# EAGLE design stm32-usb-ble-devkit (EAGLE 9.1.3)

## Sheet 1 of 4
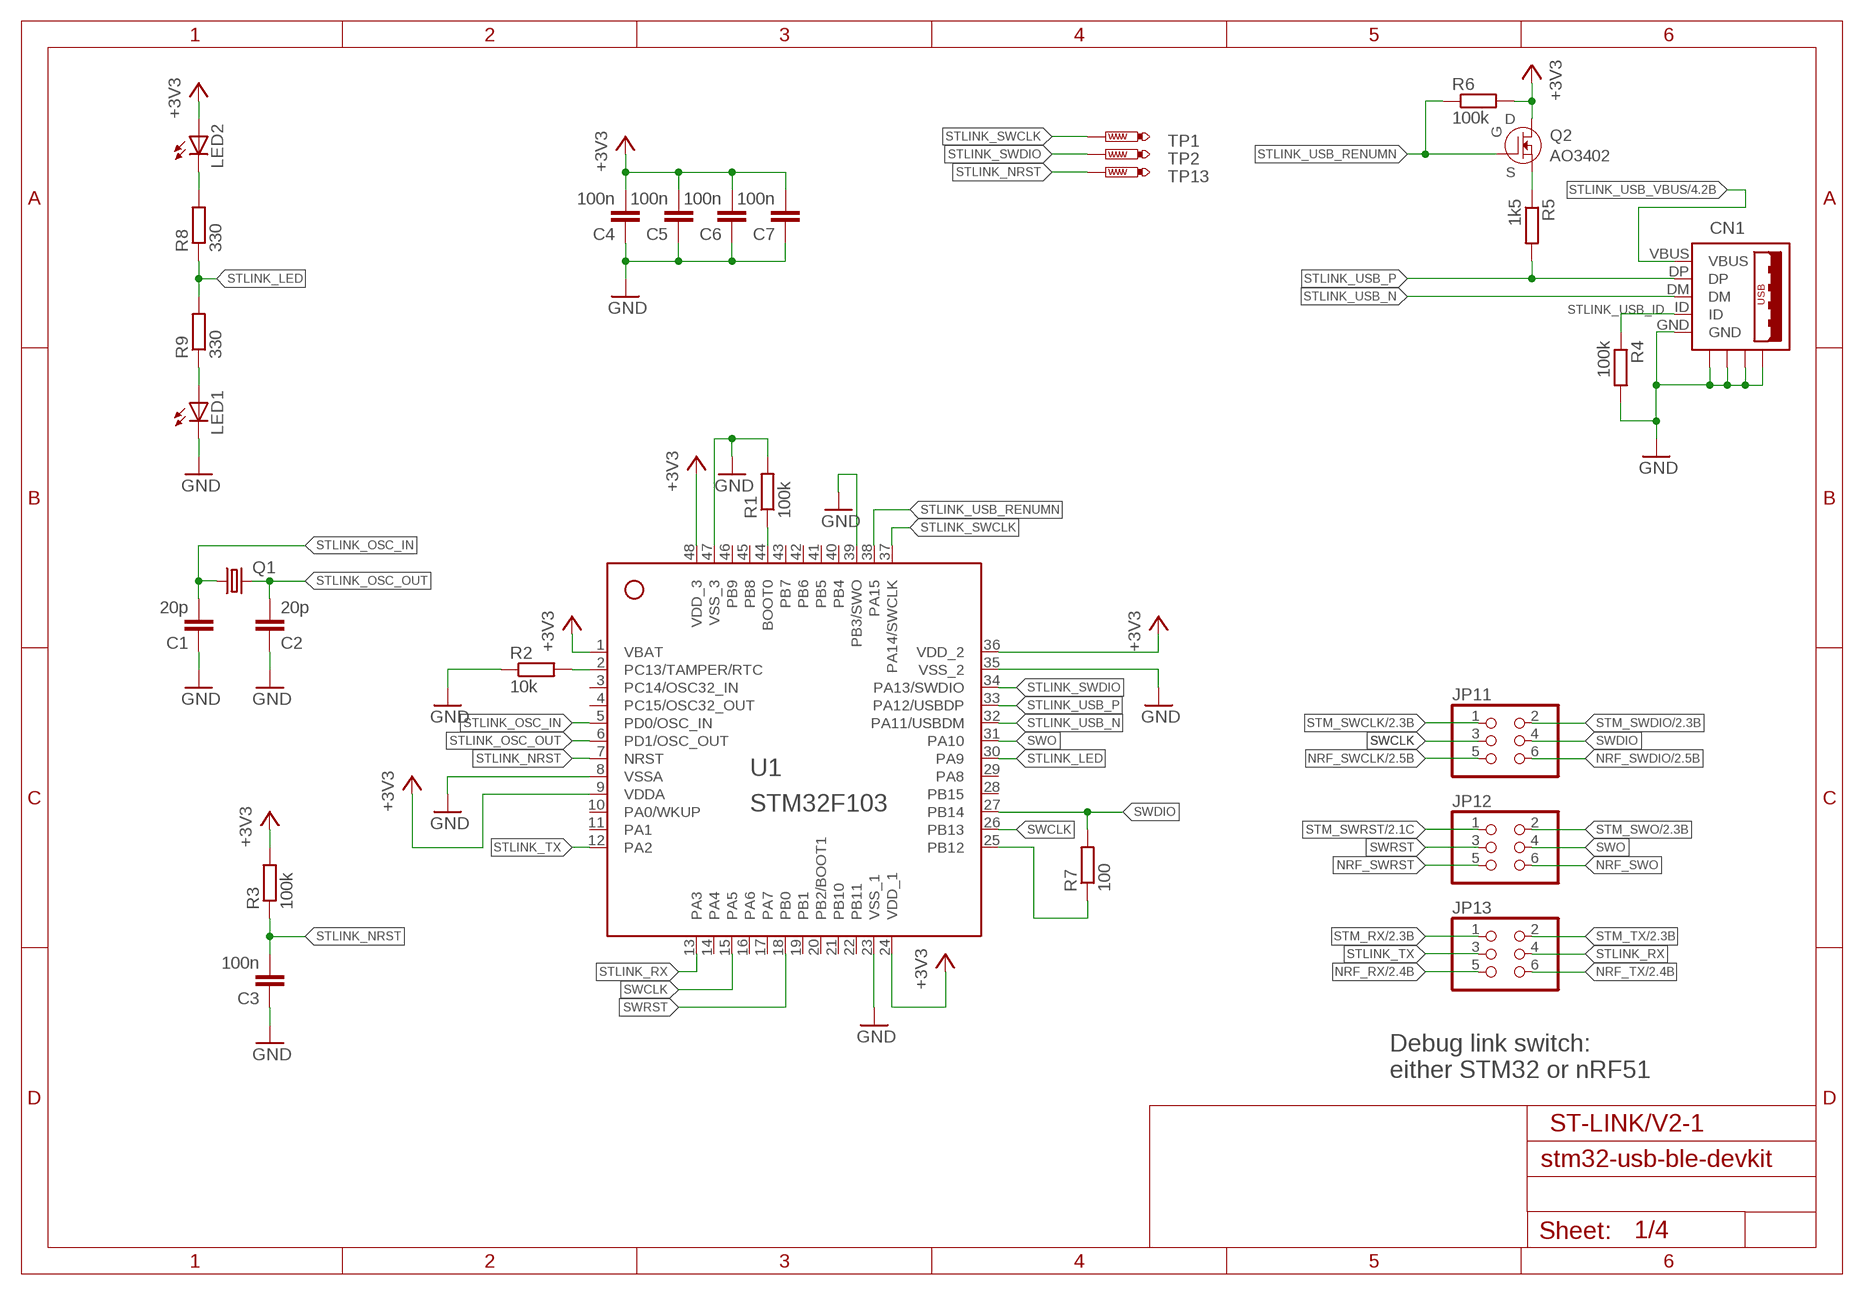
[diagram p0: schematic, sheet 1]

### Parts
C1  20p  C0603  [0603]
C2  20p  C0603  [0603]
C3  100n  C0603  [0603]
C4  100n  C0603  [0603]
C5  100n  C0603  [0603]
C6  100n  C0603  [0603]
C7  100n  C0603  [0603]
CN1  USB-MICROB-2TABS  [USB-MICROB-2]
JP11  PINHD-2X3  [2X03]
JP12  PINHD-2X3  [2X03]
JP13  PINHD-2X3  [2X03]
LED1  LEDCHIP-LED0603  [CHIP-LED0603]
LED2  LEDCHIP-LED0603  [CHIP-LED0603]
Q1  CRYSTALHC49S  [HC49/S]
Q2  AO3402  [SOT23-3]
R1  100k  RR0603  [R0603]
R2  10k  RR0603  [R0603]
R3  100k  RR0603  [R0603]
R4  100k  RR0603  [R0603]
R5  1k5  RR0603  [R0603]
R6  100k  RR0603  [R0603]
R7  100  RR0603  [R0603]
R8  330  RR0603  [R0603]
R9  330  RR0603  [R0603]
TP1  PTR1B1,27  [B1,27]
TP2  PTR1B1,27  [B1,27]
TP13  PTR1B1,27  [B1,27]
U1  STM32F103-48LQFP  [LQFP-48]

### Nets
+3V3: C4.2 C5.2 C6.2 C7.2 LED2.A Q2.3(D) R3.2 R6.2 U1.1(VBAT) U1.9(VDDA) U1.24(VDD_1) U1.36(VDD_2) U1.48(VDD_3) ; also sheet 2,3,4
GND: C1.1 C2.1 C3.1 C4.1 C5.1 C6.1 C7.1 CN1.GND CN1.GND@1(GND) CN1.GND@2(GND) CN1.GND@3(GND) CN1.GND@4(GND) LED1.C R1.2 R2.1 R4.2 U1.8(VSSA) U1.23(VSS_1) U1.35(VSS_2) U1.39(PB3/SWO) U1.47(VSS_3) ; also sheet 2,3,4
NRF_RX: JP13.5 ; also sheet 2
NRF_SWCLK: JP11.5 ; also sheet 2
NRF_SWDIO: JP11.6 ; also sheet 2
NRF_SWO: JP12.6
NRF_SWRST: JP12.5
NRF_TX: JP13.6 ; also sheet 2
STLINK_BOOT0: R1.1 U1.44(BOOT0)
STLINK_LED: R8.1 R9.2 U1.30(PA9)
STLINK_LED_RB: LED1.A R9.1
STLINK_LED_RT: LED2.C R8.2
STLINK_NRST: C3.2 R3.1 TP13.TP U1.7(NRST)
STLINK_OSC_IN: C1.2 Q1.1 U1.5(PD0/OSC_IN)
STLINK_OSC_OUT: C2.2 Q1.2 U1.6(PD1/OSC_OUT)
STLINK_PC13: R2.2 U1.2(PC13/TAMPER/RTC)
STLINK_RX: JP13.4 U1.13(PA3)
STLINK_SWCLK: TP1.TP U1.37(PA14/SWCLK)
STLINK_SWDIO: TP2.TP U1.34(PA13/SWDIO)
STLINK_SWDIO_PD: R7.1 U1.25(PB12)
STLINK_TX: JP13.3 U1.12(PA2)
STLINK_USB_ID: CN1.ID R4.1
STLINK_USB_N: CN1.DM U1.32(PA11/USBDM)
STLINK_USB_P: CN1.DP R5.2 U1.33(PA12/USBDP)
STLINK_USB_RENUM_PU: Q2.2(S) R5.1
STLINK_USB_RENUMN: Q2.1(G) R6.1 U1.38(PA15)
STLINK_USB_VBUS: CN1.VBUS ; also sheet 4
STM_RX: JP13.1 ; also sheet 2
STM_SWCLK: JP11.1 ; also sheet 2
STM_SWDIO: JP11.2 ; also sheet 2
STM_SWO: JP12.2 ; also sheet 2
STM_SWRST: JP12.1 ; also sheet 2
STM_TX: JP13.2 ; also sheet 2
SWCLK: JP11.3 U1.15(PA5) U1.26(PB13)
SWDIO: JP11.4 R7.2 U1.27(PB14)
SWO: JP12.4 U1.31(PA10)
SWRST: JP12.3 U1.18(PB0)
Unconnected: U1.3(PC14/OSC32_IN) U1.4(PC15/OSC32_OUT) U1.10(PA0/WKUP) U1.11(PA1) U1.14(PA4) U1.16(PA6) U1.17(PA7) U1.19(PB1) U1.20(PB2/BOOT1) U1.21(PB10) U1.22(PB11) U1.28(PB15) U1.29(PA8) U1.40(PB4) U1.41(PB5) U1.42(PB6) U1.43(PB7) U1.45(PB8) U1.46(PB9)

### Notes on the sheet
- Debug link switch:
  either STM32 or nRF51
- ST-LINK/V2-1

## Sheet 2 of 4
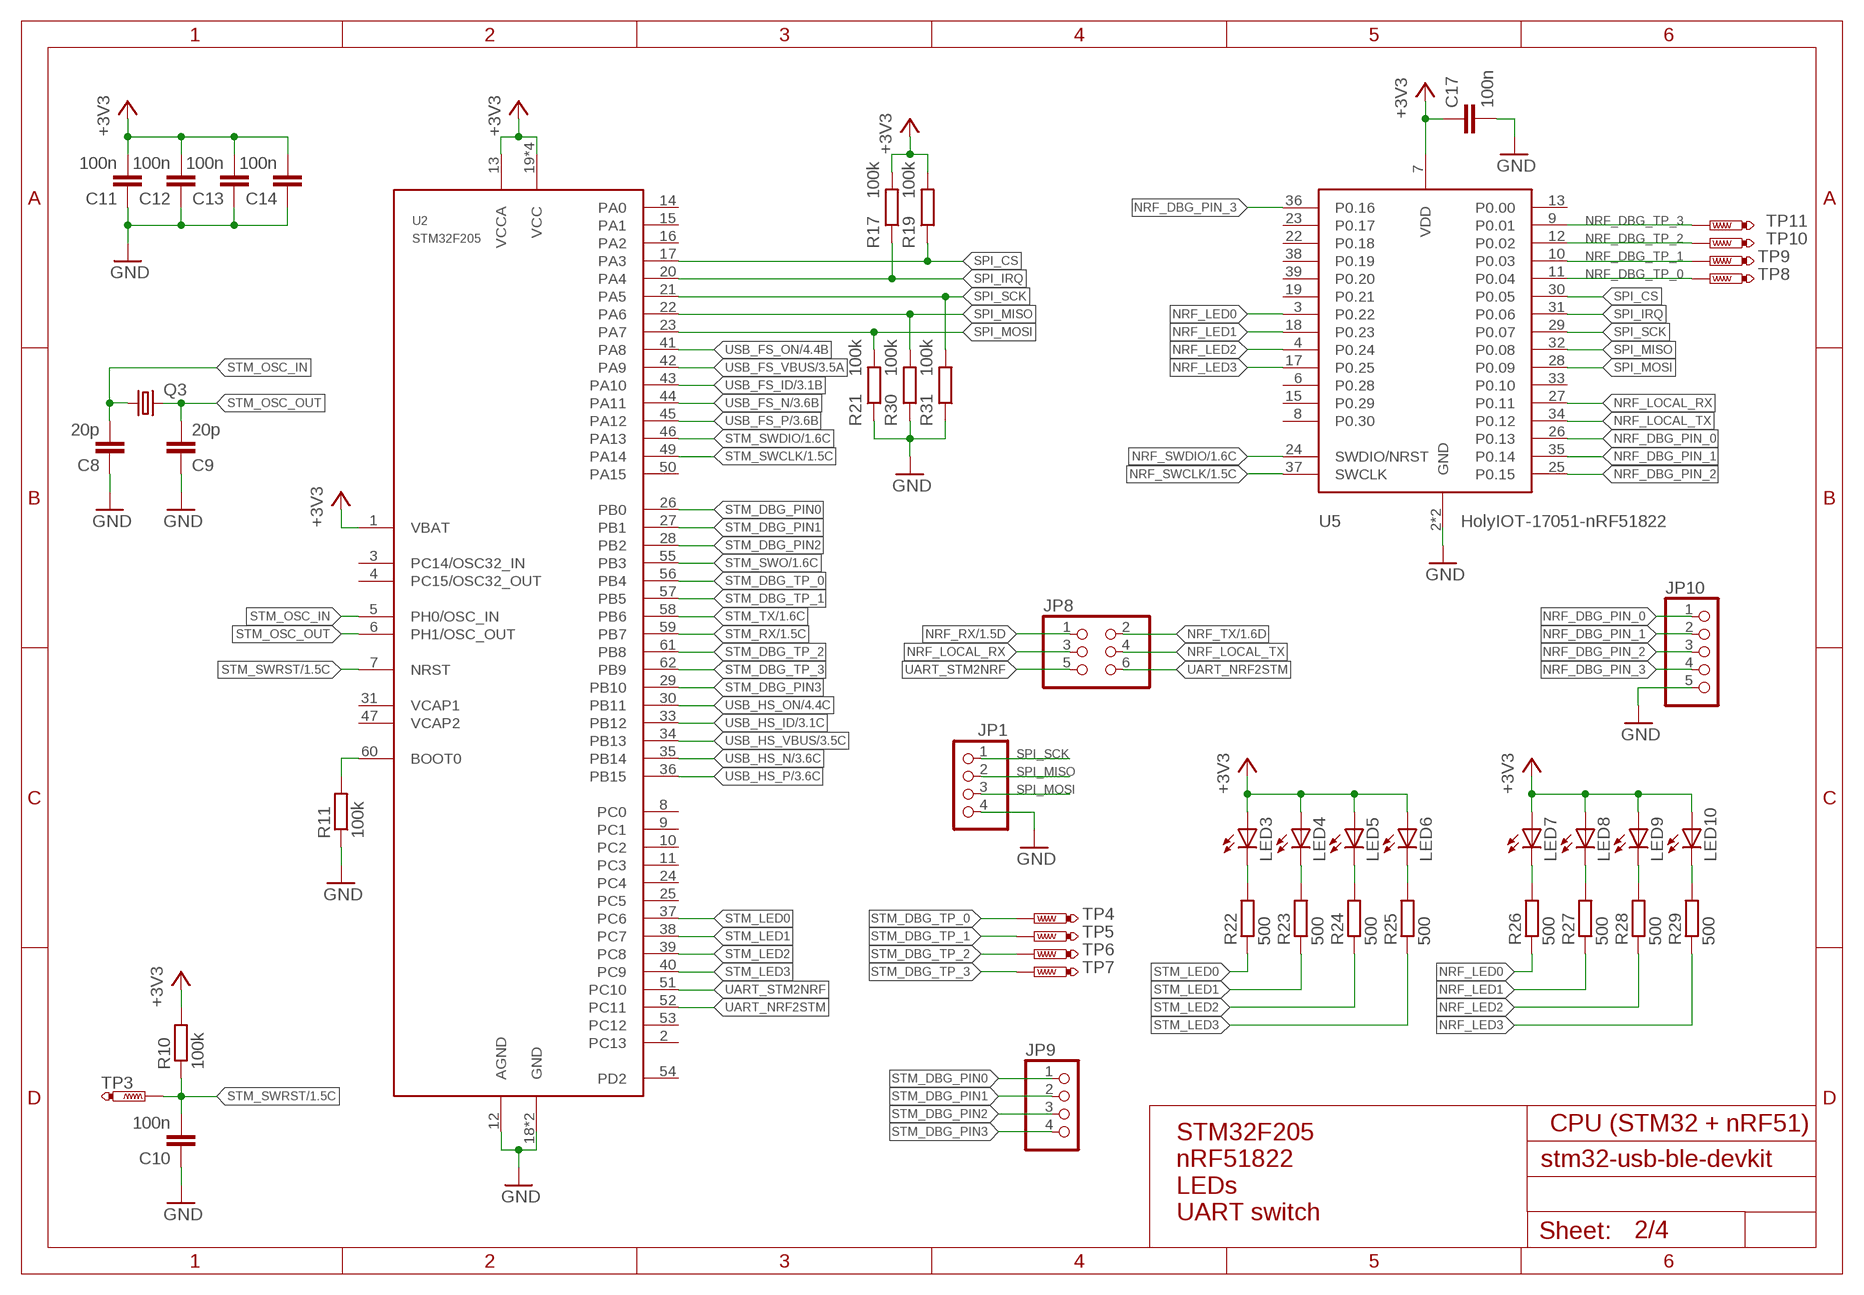
[diagram p1: schematic, sheet 2]

### Parts
C8  20p  C0603  [0603]
C9  20p  C0603  [0603]
C10  100n  C0603  [0603]
C11  100n  C0603  [0603]
C12  100n  C0603  [0603]
C13  100n  C0603  [0603]
C14  100n  C0603  [0603]
C17  100n  C0603  [0603]
JP1  PINHD-1X4  [1X04]
JP8  PINHD-2X3  [2X03]
JP9  PINHD-1X4  [1X04]
JP10  PINHD-1X5  [1X05]
LED3  LEDCHIP-LED0603  [CHIP-LED0603]
LED4  LEDCHIP-LED0603  [CHIP-LED0603]
LED5  LEDCHIP-LED0603  [CHIP-LED0603]
LED6  LEDCHIP-LED0603  [CHIP-LED0603]
LED7  LEDCHIP-LED0603  [CHIP-LED0603]
LED8  LEDCHIP-LED0603  [CHIP-LED0603]
LED9  LEDCHIP-LED0603  [CHIP-LED0603]
LED10  LEDCHIP-LED0603  [CHIP-LED0603]
Q3  CRYSTALHC49S  [HC49/S]
R10  100k  RR0603  [R0603]
R11  100k  RR0603  [R0603]
R17  100k  RR0603  [R0603]
R19  100k  RR0603  [R0603]
R21  100k  RR0603  [R0603]
R22  500  RR0603  [R0603]
R23  500  RR0603  [R0603]
R24  500  RR0603  [R0603]
R25  500  RR0603  [R0603]
R26  500  RR0603  [R0603]
R27  500  RR0603  [R0603]
R28  500  RR0603  [R0603]
R29  500  RR0603  [R0603]
R30  100k  RR0603  [R0603]
R31  100k  RR0603  [R0603]
TP3  PTR1B1,27  [B1,27]
TP4  PTR1B1,27  [B1,27]
TP5  PTR1B1,27  [B1,27]
TP6  PTR1B1,27  [B1,27]
TP7  PTR1B1,27  [B1,27]
TP8  PTR1B1,27  [B1,27]
TP9  PTR1B1,27  [B1,27]
TP10  PTR1B1,27  [B1,27]
TP11  PTR1B1,27  [B1,27]
U2  STM32F205-64  [LQFP-64]
U5  HOLYIOT-17051-NRF51822  [HOLYIOT-17051-NRF51822]

### Nets
+3V3: C11.2 C12.2 C13.2 C14.2 C17.1 LED3.A LED4.A LED5.A LED6.A LED7.A LED8.A LED9.A LED10.A R10.2 R17.2 R19.2 U2.1(VBAT) U2.13(VCCA) U2.19(VCC) U2.32(VCC) U2.48(VCC) U2.64(VCC) U5.7(VDD) ; also sheet 1,3,4
BOOT0: R11.2 U2.60(BOOT0)
GND: C8.1 C9.1 C10.1 C11.1 C12.1 C13.1 C14.1 C17.2 JP1.4 JP10.5 R11.1 R21.1 R30.1 R31.1 U2.12(AGND) U2.18(GND) U2.63(GND) U5.2(GND) U5.14(GND) ; also sheet 1,3,4
NRF_DBG_PIN_0: JP10.1 U5.26(P0.13)
NRF_DBG_PIN_1: JP10.2 U5.35(P0.14)
NRF_DBG_PIN_2: JP10.3 U5.25(P0.15)
NRF_DBG_PIN_3: JP10.4 U5.36(P0.16)
NRF_DBG_TP_0: TP8.TP U5.11(P0.04)
NRF_DBG_TP_1: TP9.TP U5.10(P0.03)
NRF_DBG_TP_2: TP10.TP U5.12(P0.02)
NRF_DBG_TP_3: TP11.TP U5.9(P0.01)
NRF_LED0: R26.1 U5.3(P0.22)
NRF_LED1: R27.1 U5.18(P0.23)
NRF_LED2: R28.1 U5.4(P0.24)
NRF_LED3: R29.1 U5.17(P0.25)
NRF_LEDR0: LED7.C R26.2
NRF_LEDR1: LED8.C R27.2
NRF_LEDR2: LED9.C R28.2
NRF_LEDR3: LED10.C R29.2
NRF_LOCAL_RX: JP8.3 U5.27(P0.11)
NRF_LOCAL_TX: JP8.4 U5.34(P0.12)
NRF_RX: JP8.1 ; also sheet 1
NRF_SWCLK: U5.37(SWCLK) ; also sheet 1
NRF_SWDIO: U5.24(SWDIO/NRST) ; also sheet 1
NRF_TX: JP8.2 ; also sheet 1
SPI_CS: R19.1 U2.17(PA3) U5.30(P0.05)
SPI_IRQ: R17.1 U2.20(PA4) U5.31(P0.06)
SPI_MISO: JP1.2 R30.2 U2.22(PA6) U5.32(P0.08)
SPI_MOSI: JP1.3 R21.2 U2.23(PA7) U5.28(P0.09)
SPI_SCK: JP1.1 R31.2 U2.21(PA5) U5.29(P0.07)
STM_DBG_PIN0: JP9.1 U2.26(PB0)
STM_DBG_PIN1: JP9.2 U2.27(PB1)
STM_DBG_PIN2: JP9.3 U2.28(PB2)
STM_DBG_PIN3: JP9.4 U2.29(PB10)
STM_DBG_TP_0: TP4.TP U2.56(PB4)
STM_DBG_TP_1: TP5.TP U2.57(PB5)
STM_DBG_TP_2: TP6.TP U2.61(PB8)
STM_DBG_TP_3: TP7.TP U2.62(PB9)
STM_LED0: R22.1 U2.37(PC6)
STM_LED1: R23.1 U2.38(PC7)
STM_LED2: R24.1 U2.39(PC8)
STM_LED3: R25.1 U2.40(PC9)
STM_LEDR0: LED3.C R22.2
STM_LEDR1: LED4.C R23.2
STM_LEDR3: LED6.C R25.2
STM_LEDR_2: LED5.C R24.2
STM_OSC_IN: C8.2 Q3.1 U2.5(PH0/OSC_IN)
STM_OSC_OUT: C9.2 Q3.2 U2.6(PH1/OSC_OUT)
STM_RX: U2.59(PB7) ; also sheet 1
STM_SWCLK: U2.49(PA14) ; also sheet 1
STM_SWDIO: U2.46(PA13) ; also sheet 1
STM_SWO: U2.55(PB3) ; also sheet 1
STM_SWRST: C10.2 R10.1 TP3.TP U2.7(NRST) ; also sheet 1
STM_TX: U2.58(PB6) ; also sheet 1
UART_NRF2STM: JP8.6 U2.52(PC11)
UART_STM2NRF: JP8.5 U2.51(PC10)
USB_FS_ID: U2.43(PA10) ; also sheet 3
USB_FS_N: U2.44(PA11) ; also sheet 3
USB_FS_ON: U2.41(PA8) ; also sheet 4
USB_FS_P: U2.45(PA12) ; also sheet 3
USB_FS_VBUS: U2.42(PA9) ; also sheet 3,4
USB_HS_ID: U2.33(PB12) ; also sheet 3
USB_HS_N: U2.35(PB14) ; also sheet 3
USB_HS_ON: U2.30(PB11) ; also sheet 4
USB_HS_P: U2.36(PB15) ; also sheet 3
USB_HS_VBUS: U2.34(PB13) ; also sheet 3,4
Unconnected: U2.2(PC13) U2.3(PC14/OSC32_IN) U2.4(PC15/OSC32_OUT) U2.8(PC0) U2.9(PC1) U2.10(PC2) U2.11(PC3) U2.14(PA0) U2.15(PA1) U2.16(PA2) U2.24(PC4) U2.25(PC5) U2.31(VCAP1) U2.47(VCAP2) U2.50(PA15) U2.53(PC12) U2.54(PD2) U5.6(P0.28) U5.8(P0.30) U5.13(P0.00) U5.15(P0.29) U5.19(P0.21) U5.22(P0.18) U5.23(P0.17) U5.33(P0.10) U5.38(P0.19) U5.39(P0.20)

### Notes on the sheet
- CPU (STM32 + nRF51)
- STM32F205
  nRF51822
  LEDs
  UART switch

## Sheet 3 of 4
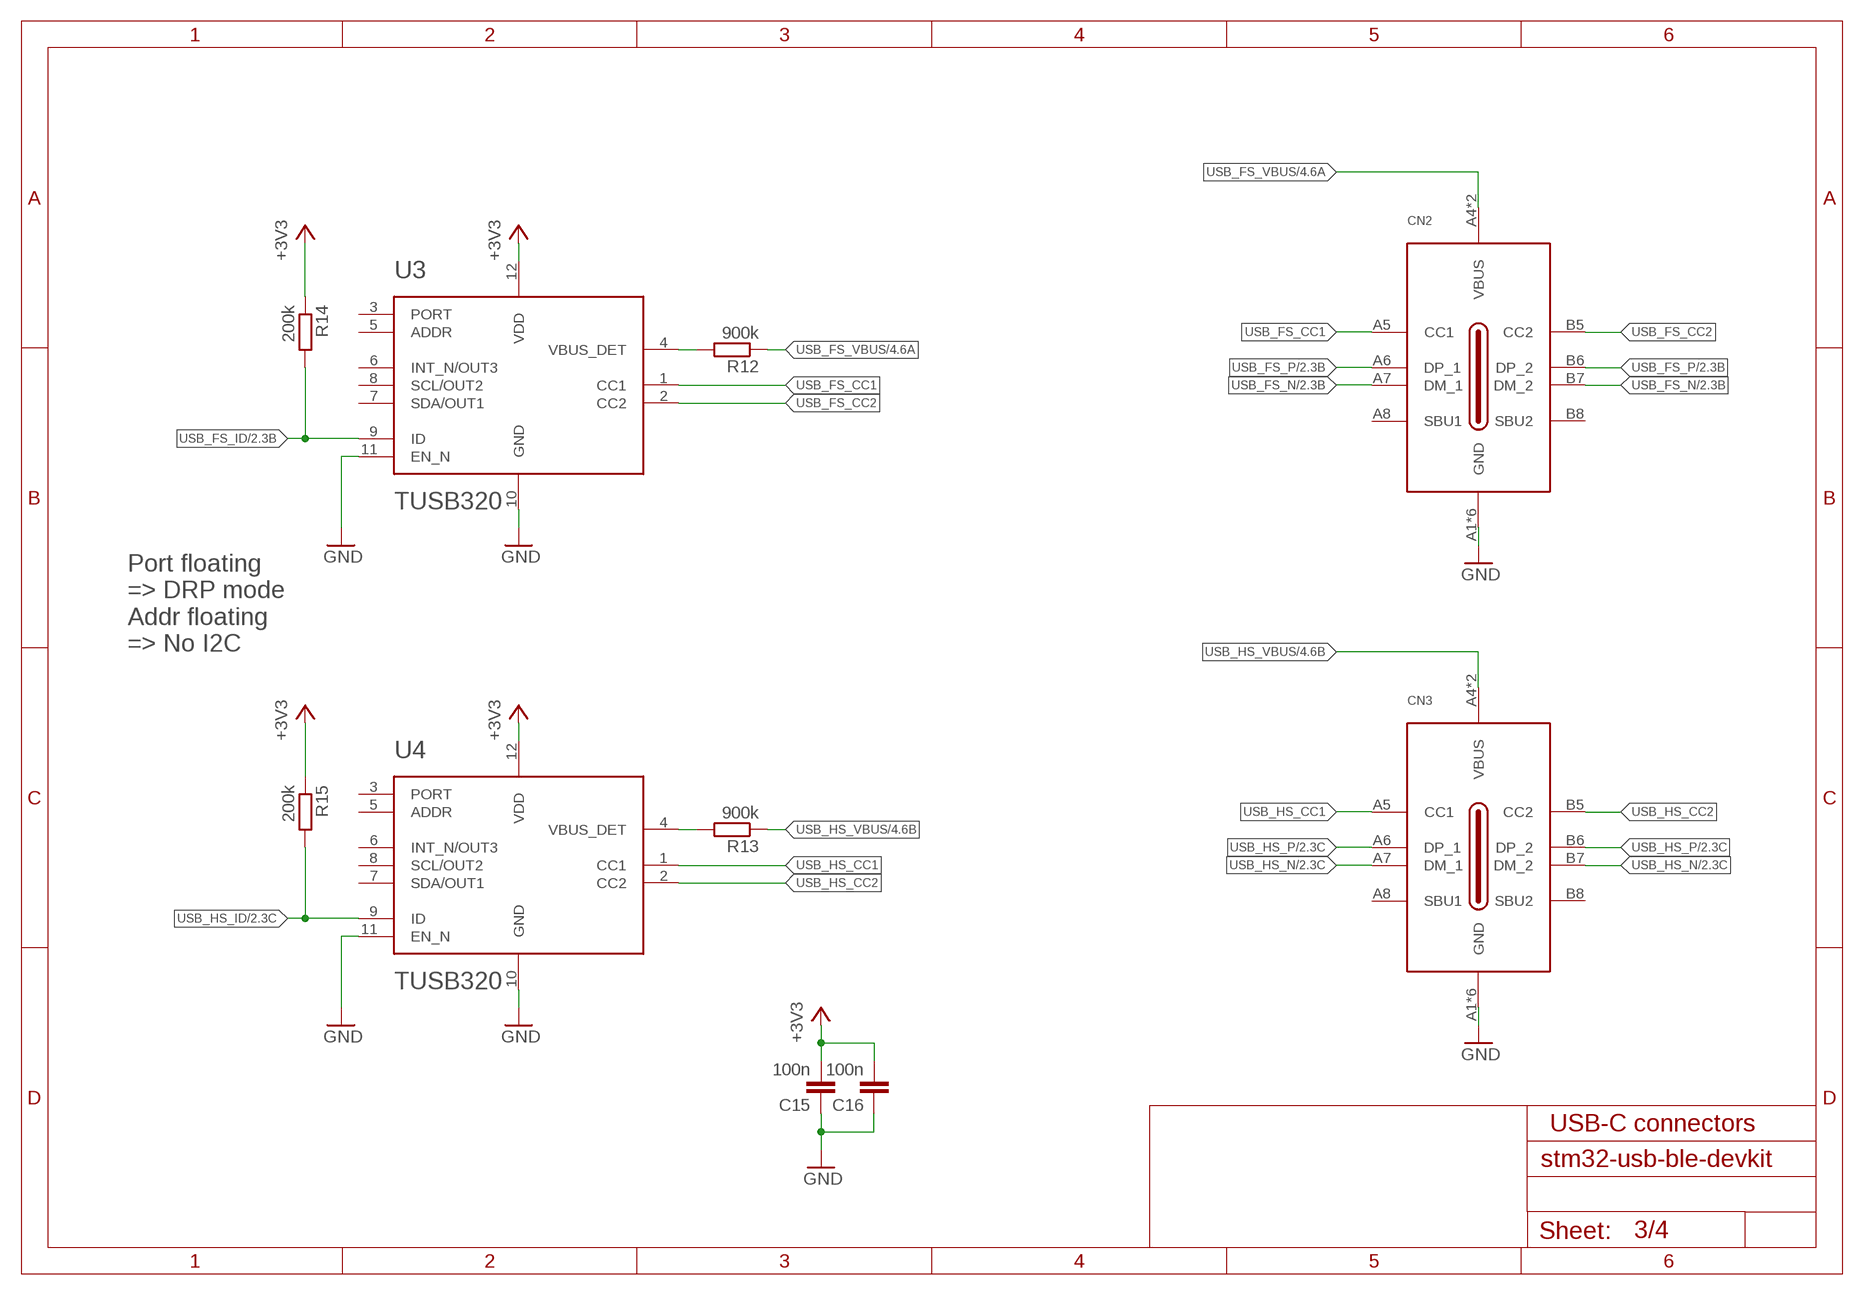
[diagram p2: schematic, sheet 3]

### Parts
C15  100n  C0603  [0603]
C16  100n  C0603  [0603]
CN2  USB-C-2.0-FEMALE  [USB-C-FEMALE]
CN3  USB-C-2.0-FEMALE  [USB-C-FEMALE]
R12  900k  RR0603  [R0603]
R13  900k  RR0603  [R0603]
R14  200k  RR0603  [R0603]
R15  200k  RR0603  [R0603]
U3  TUSB320  [X2QFN-0.4]
U4  TUSB320  [X2QFN-0.4]

### Nets
+3V3: C15.2 C16.2 R14.1 R15.1 U3.12(VDD) U4.12(VDD) ; also sheet 1,2,4
GND: C15.1 C16.1 CN2.A1(GND) CN2.A12(GND) CN2.G1(GND) CN2.G2(GND) CN2.G3(GND) CN2.G4(GND) CN3.A1(GND) CN3.A12(GND) CN3.G1(GND) CN3.G2(GND) CN3.G3(GND) CN3.G4(GND) U3.10(GND) U3.11(EN_N) U4.10(GND) U4.11(EN_N) ; also sheet 1,2,4
USB_FS_CC1: CN2.A5(CC1) U3.1(CC1)
USB_FS_CC2: CN2.B5(CC2) U3.2(CC2)
USB_FS_ID: R14.2 U3.9(ID) ; also sheet 2
USB_FS_N: CN2.A7(DM_1) CN2.B7(DM_2) ; also sheet 2
USB_FS_P: CN2.A6(DP_1) CN2.B6(DP_2) ; also sheet 2
USB_FS_VBUS: CN2.A4(VBUS) CN2.A9(VBUS) R12.1 ; also sheet 2,4
USB_FS_VBUS_DET: R12.2 U3.4(VBUS_DET)
USB_HS_CC1: CN3.A5(CC1) U4.1(CC1)
USB_HS_CC2: CN3.B5(CC2) U4.2(CC2)
USB_HS_ID: R15.2 U4.9(ID) ; also sheet 2
USB_HS_N: CN3.A7(DM_1) CN3.B7(DM_2) ; also sheet 2
USB_HS_P: CN3.A6(DP_1) CN3.B6(DP_2) ; also sheet 2
USB_HS_VBUS: CN3.A4(VBUS) CN3.A9(VBUS) R13.1 ; also sheet 2,4
USB_HS_VBUS_DET: R13.2 U4.4(VBUS_DET)
Unconnected: CN2.A8(SBU1) CN2.B8(SBU2) CN3.A8(SBU1) CN3.B8(SBU2) U3.3(PORT) U3.5(ADDR) U3.6(INT_N/OUT3) U3.7(SDA/OUT1) U3.8(SCL/OUT2) U4.3(PORT) U4.5(ADDR) U4.6(INT_N/OUT3) U4.7(SDA/OUT1) U4.8(SCL/OUT2)

### Notes on the sheet
- Port floating
  => DRP mode
  Addr floating
  => No I2C
- USB-C connectors

## Sheet 4 of 4
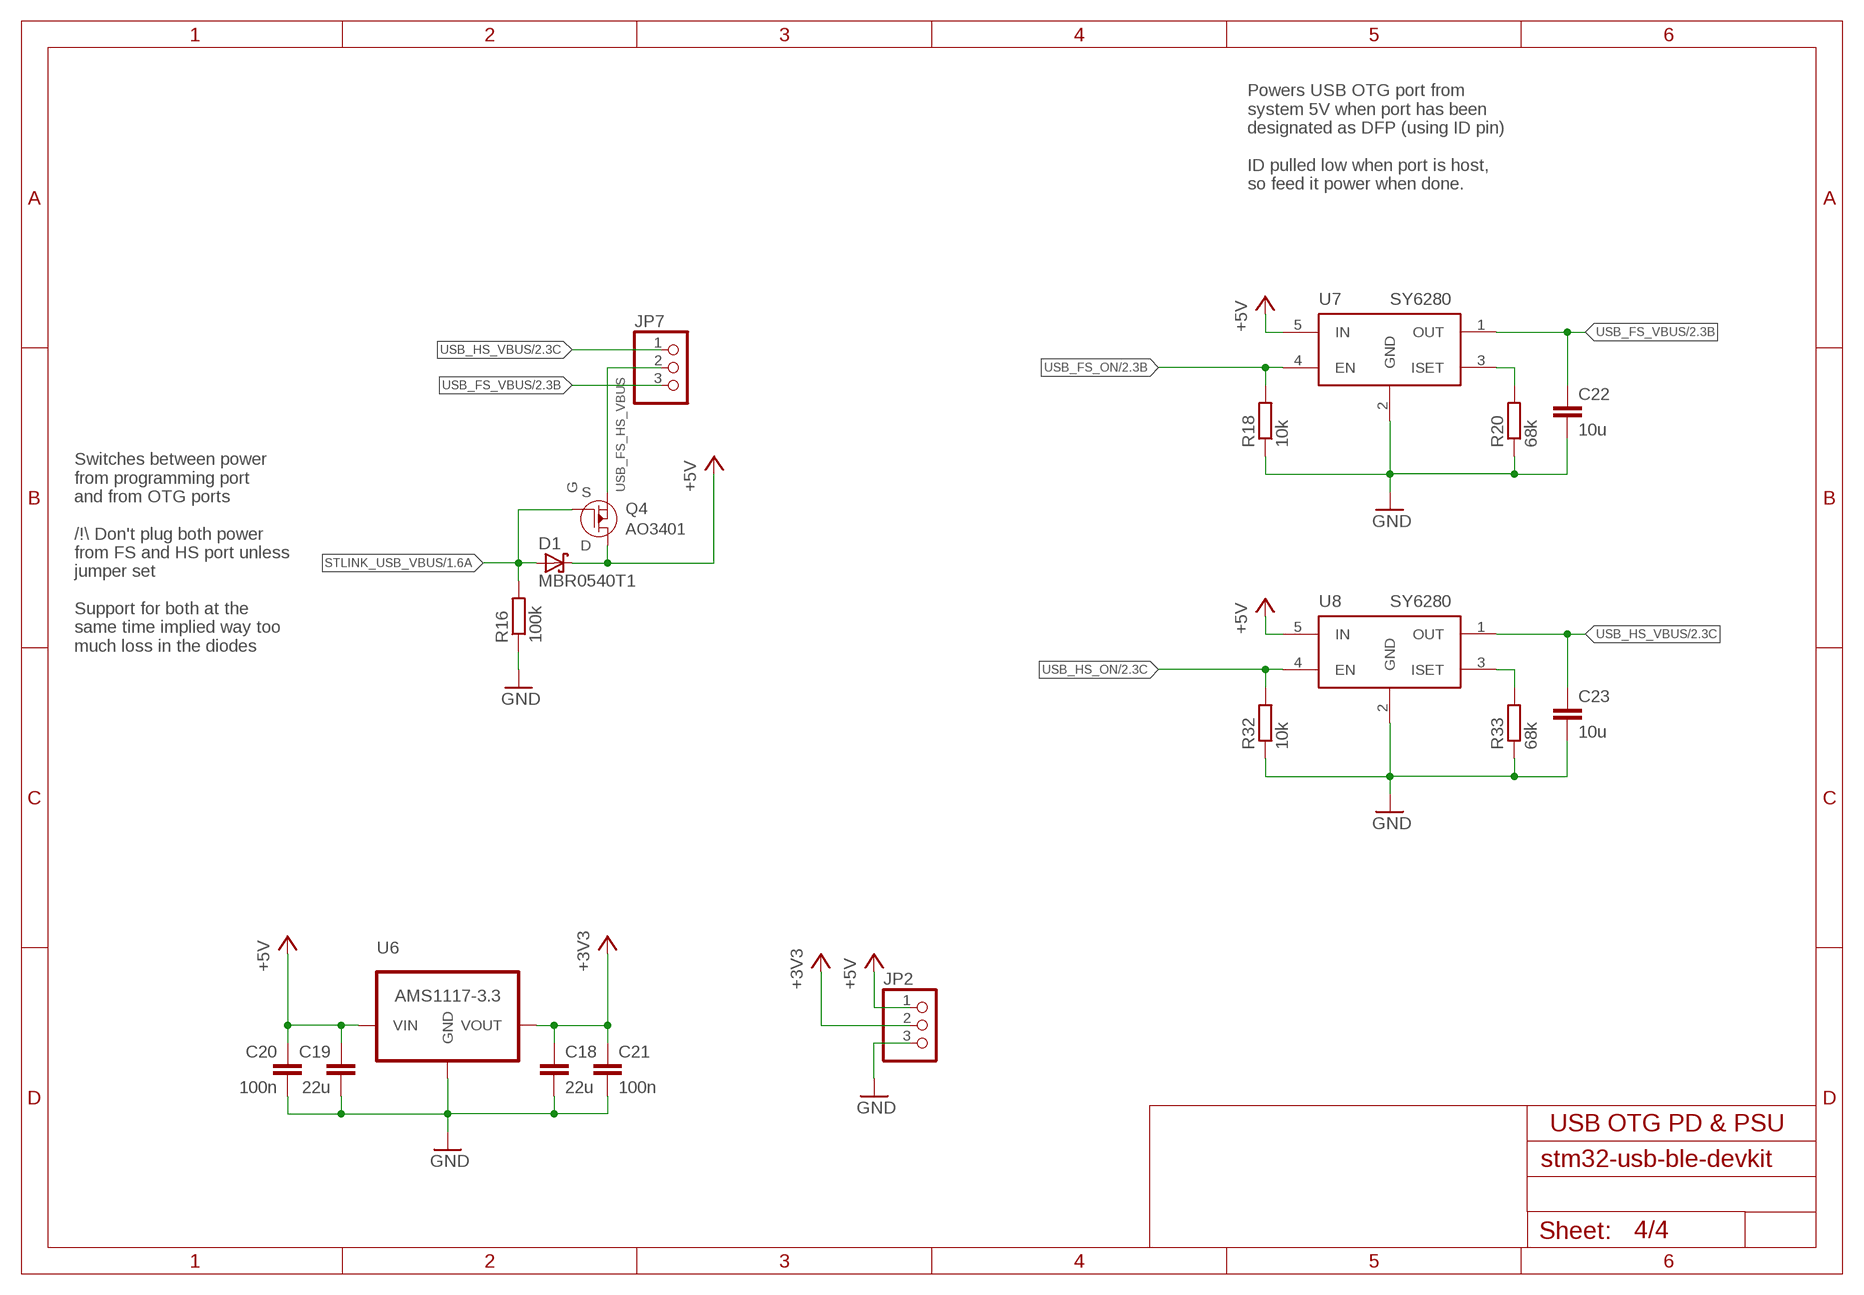
[diagram p3: schematic, sheet 4]

### Parts
C18  22u  C0603  [0603]
C19  22u  C0603  [0603]
C20  100n  C0603  [0603]
C21  100n  C0603  [0603]
C22  10u  C0603  [0603]
C23  10u  C0603  [0603]
D1  MBR0540T1  [SOD123]
JP2  PINHD-1X3  [1X03]
JP7  PINHD-1X3  [1X03]
Q4  AO3401  [SOT23-3]
R16  100k  RR0603  [R0603]
R18  10k  RR0603  [R0603]
R20  68k  RR0603  [R0603]
R32  10k  RR0603  [R0603]
R33  68k  RR0603  [R0603]
U6  AMS1117-3.3  LDOAMS1117  [SOT223]
U7  SY6280  [SOT23-5]
U8  SY6280  [SOT23-5]

### Nets
+3V3: C18.1 C21.1 JP2.2 U6.2(VOUT) ; also sheet 1,2,3
+5V: C19.1 C20.1 D1.C JP2.1 Q4.3(D) U6.3(VIN) U7.5(IN) U8.5(IN)
GND: C18.2 C19.2 C20.2 C21.2 C22.2 C23.2 JP2.3 R16.1 R18.1 R20.1 R32.1 R33.1 U6.1(GND) U7.2(GND) U8.2(GND) ; also sheet 1,2,3
STLINK_USB_VBUS: D1.A Q4.1(G) R16.2 ; also sheet 1
USB_FS_HS_VBUS: JP7.2 Q4.2(S)
USB_FS_ISET: R20.2 U7.3(ISET)
USB_FS_ON: R18.2 U7.4(EN) ; also sheet 2
USB_FS_VBUS: C22.1 JP7.3 U7.1(OUT) ; also sheet 2,3
USB_HS_ISET: R33.2 U8.3(ISET)
USB_HS_ON: R32.2 U8.4(EN) ; also sheet 2
USB_HS_VBUS: C23.1 JP7.1 U8.1(OUT) ; also sheet 2,3

### Notes on the sheet
- Powers USB OTG port from
  system 5V when port has been
  designated as DFP (using ID pin)
  
  ID pulled low when port is host,
  so feed it power when done.
- Switches between power
  from programming port
  and from OTG ports
  
  /\!\\ Don't plug both power
  from FS and HS port unless
  jumper set
  
  Support for both at the
  same time implied way too
  much loss in the diodes
- USB OTG PD & PSU

## Library data of the parts
C1-C23 = tuetuopay:C
CN1 = tuetuopay:USB-MICROB
CN2 CN3 = tuetuopay:USB-C-2.0-FEMALE: 90° female USB-C socket up to USB 2.0
D1 = tuetuopay:MBR0540T1
JP1 JP9 = tuetuopay:PINHD-1X4: PIN HEADER
JP2 JP7 = tuetuopay:PINHD-1X3: PIN HEADER
JP8 JP11-JP13 = pinhead:PINHD-2X3: PIN HEADER
JP10 = tuetuopay:PINHD-1X5: PIN HEADER
LED1-LED10 = led:LED: LED OSRAM: - CHIPLED LG R971, LG N971, LY N971, LG Q971, LY Q971, LO R971, LY R971 LH N974, LH R974 LS Q976, LO Q976, LY Q976 LO Q996 - Hyper CHIPLED LW Q18S LB Q993, LB Q99A, LB R99A - SideLED LS A670, LO A670, LY A670, LG A670, LP A670 LB A673, LV A673, LT A673, LW A673 LH A674 LY A675 LS A676, LA A676, LO A676, LY A676, LW A676 LS A679, LY A679, LG A679 - Hyper Micro SIDELED® LS Y876, LA Y876, LO Y876, LY Y876 LT Y87S - SmartLED LW L88C, LW L88S LB L89C, LB L89S, LG L890 LS L89K, LO L89K, LY L89K LS L896, LA L896, LO L896, LY L896 - TOPLED LS T670, LO T670, LY T670, LG T670, LP T670 LSG T670, LSP T670, LSY T670, LOP T670, LYG T670 LG T671, LOG T671, LSG T671 LB T673, LV T673, LT T673, LW T673 LH T674 LS T676, LA T676, LO T676, LY T676, LB T676, LH T676, LSB T676, LW T676 LB T67C, LV T67C, LT T67C, LS T67K, LO T67K, LY T67K, LW E67C LS E67B, LA E67B, LO E67B, LY E67B, LB E67C, LV E67C, LT E67C LW T67C LS T679, LY T679, LG T679 LS T770, LO T770, LY T770, LG T770, LP T770 LB T773, LV T773, LT T773, LW T773 LH T774 LS E675, LA E675, LY E675, LS T675 LS T776, LA T776, LO T776, LY T776, LB T776 LHGB T686 LT T68C, LB T68C - Hyper Mini TOPLED® LB M676 - Mini TOPLED Santana® LG M470 LS M47K, LO M47K, LY M47K Source: http://www.osram.convergy.de LUXEON: - LUMILED® LXK2-PW12-R00, LXK2-PW12-S00, LXK2-PW14-U00, LXK2-PW14-V00 LXK2-PM12-R00, LXK2-PM12-S00, LXK2-PM14-U00 LXK2-PE12-Q00, LXK2-PE12-R00, LXK2-PE12-S00, LXK2-PE14-T00, LXK2-PE14-U00 LXK2-PB12-K00, LXK2-PB12-L00, LXK2-PB12-M00, LXK2-PB14-N00, LXK2-PB14-P00, LXK2-PB14-Q00 LXK2-PR12-L00, LXK2-PR12-M00, LXK2-PR14-Q00, LXK2-PR14-R00 LXK2-PD12-Q00, LXK2-PD12-R00, LXK2-PD12-S00 LXK2-PH12-R00, LXK2-PH12-S00 LXK2-PL12-P00, LXK2-PL12-Q00, LXK2-PL12-R00 Source: www.luxeon.com KINGBRIGHT: KA-3528ASYC Source: www.kingbright.com
Q1 Q3 = crystal:CRYSTAL: CRYSTAL; OC_FARNELL: 1667008; OC_NEWARK: unknown
Q2 = tuetuopay:AO3402
Q4 = tuetuopay:AO3401
R1-R33 = tuetuopay:R: RESISTOR, European symbol
TP1-TP11 TP13 = testpad:PTR1: TEST PIN
U1 = tuetuopay:STM32F103-48
U2 = tuetuopay:STM32F205-64
U3 U4 = tuetuopay:TUSB320
U5 = tuetuopay:HOLYIOT-17051-NRF51822
U6 = tuetuopay:LDO
U7 U8 = tuetuopay:SY6280

## Board
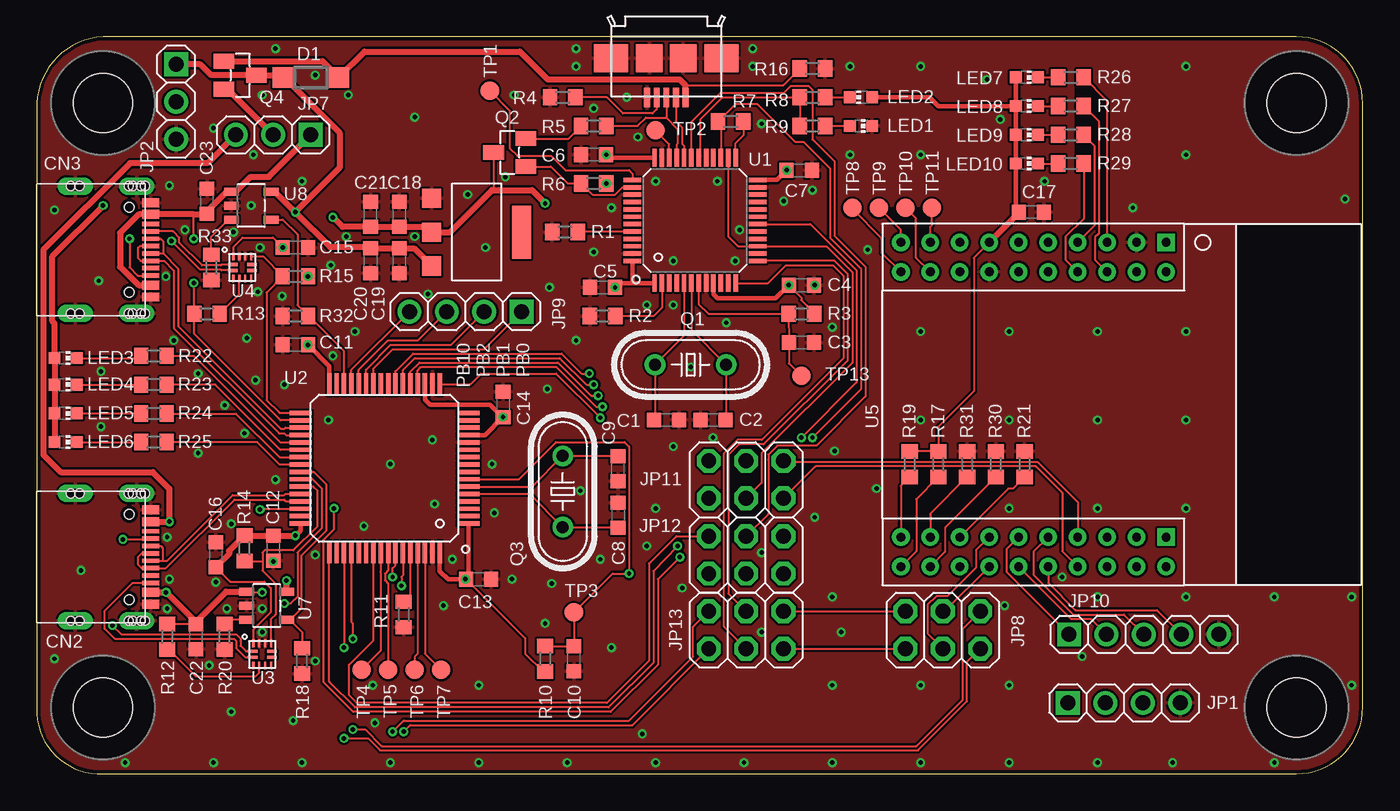
[diagram p4: board, top side]
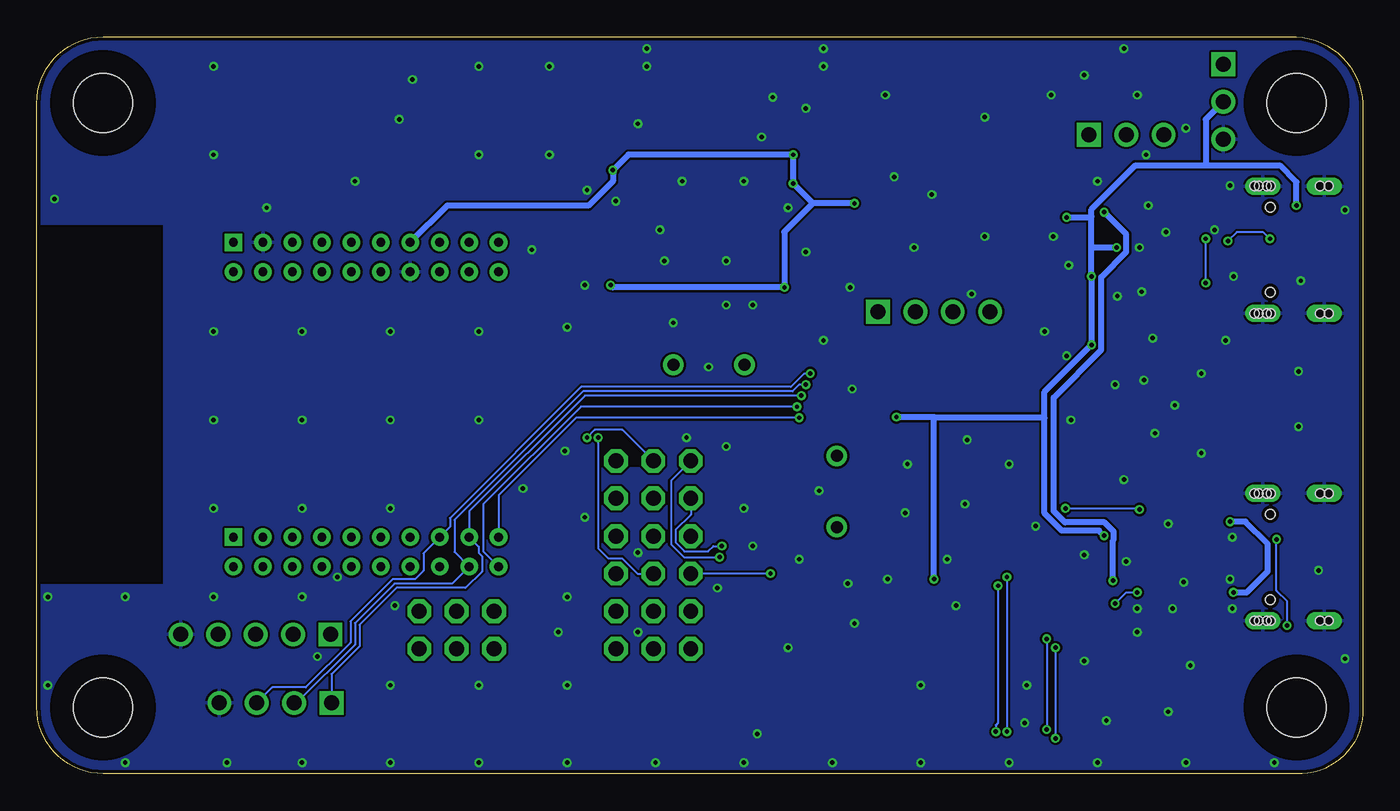
[diagram p5: board, bottom side, seen from below]

Size 90 x 50 mm. Coordinates in mm from the lower left corner, seen from the top.
Outline: 4.5,0 85.5,0 arc90 90,4.5 90,45.5 arc90 85.5,50 4.5,50 arc90 0,45.05 0,4.05 arc90 4.5,0
Copper layers (1*16): Top 0.035mm / dielectric 1.5mm / Bottom 0.035mm
Design rules "jlcpcb *": minimum track width 0.15mm, minimum drill 0.3mm, track to track 0.15mm, track to pad 0.15mm, pad to pad 0.15mm, via to via 0.15mm, smd to smd 0.15mm, copper to edge 0.25mm, drill to drill 6mil, minimum pad ring 0.3mm, minimum via ring 0.15mm, stop-mask expansion 0.05mm, vias tented up to drill 0.3mm, thermal gap 0.15mm
Holes 4 mm at 4.5,45.5 4.5,4.5 85.5,4.5 85.5,45.5
tRestrict: area 1,1 to 8,8; area 1,42 to 8,49; area 82,42 to 89,49; area 82,1 to 89,8; area 81.5,12.9 to 89.9,37.2; 8 lines
bRestrict: area 1,1 to 8,8; area 1,42 to 8,49; area 82,42 to 89,49; area 82,1 to 89,8; area 81.5,12.9 to 89.9,37.2; 1 lines

### Footprints (pad centres in the part's own frame; a part is rotated, then mirrored left to right if it is on the bottom)
0603 = smd 0.95 x 1: 1 -0.85,0; 2 0.85,0
USB-MICROB-2 = smd 0.4 x 1.35: DM -0.65,2.675; DP 0,2.675; GND 1.3,2.675; ID 0.65,2.675; VBUS -1.3,2.675 | smd 2.3 x 1.9: GND@1 -3.75,0; GND@4 3.75,0 | smd 1.8 x 1.9: GND@2 -1.15,0; GND@3 1.15,0
USB-C-FEMALE = smd 0.6 x 1.15: A1 -3.2,7.73; A4 -2.4,7.73; A9 2.4,7.73; A12 3.2,7.73 | smd 0.3 x 1.15: A5 -1.25,7.73; A6 -0.25,7.73; A7 0.25,7.73; A8 1.25,7.73; B5 1.75,7.73; B6 0.75,7.73; B7 -0.75,7.73; B8 -1.75,7.73 | drill 0.6 long: G1 4.32,6.78; G2 -4.32,6.78; G3 -4.32,2.6; G4 4.32,2.6 | hole 0.65: 2.89,6.28; -2.89,6.28 | hole 0.6: -4.32,2.9; -4.32,2.3; 4.32,2.9; 4.32,2.3; -4.32,6.23; -4.32,7.33; -4.32,7.055; -4.32,6.505; 4.32,6.23; 4.32,7.33; 4.32,7.055; 4.32,6.505
SOD123 = smd 1.4 x 1.4: A 1.9,0; C -1.9,0
1X04 = drill 1.016 square: 1 -3.81,0 | drill 1.016: 2 -1.27,0; 3 1.27,0; 4 3.81,0
1X03 = drill 1.016 square: 1 -2.54,0 | drill 1.016: 2 0,0; 3 2.54,0
2X03 = drill 1.016 octagon: 1 -2.54,-1.27; 2 -2.54,1.27; 3 0,-1.27; 4 0,1.27; 5 2.54,-1.27; 6 2.54,1.27
1X05 = drill 1.016 square: 1 -5.08,0 | drill 1.016: 2 -2.54,0; 3 0,0; 4 2.54,0; 5 5.08,0
CHIP-LED0603 = smd 0.8 x 0.8: A 0,-0.75; C 0,0.75
HC49/S = drill 0.813: 1 -2.413,0; 2 2.413,0
SOT23-3 = smd 1 x 1.4: 1 -0.95,-1.1; 2 0.95,-1.1; 3 0,1.1
R0603 = smd 0.975 x 1.1: 1 -0.863,0; 2 0.863,0
B1,27 = smd 1.27 x 1.27: TP 0,0
LQFP-48 = smd 0.3 x 1.2: 1 -2.75,-4.25; 2 -2.25,-4.25; 3 -1.75,-4.25; 4 -1.25,-4.25; 5 -0.75,-4.25; 6 -0.25,-4.25; 7 0.25,-4.25; 8 0.75,-4.25; 9 1.25,-4.25; 10 1.75,-4.25; 11 2.25,-4.25; 12 2.75,-4.25; 25 2.75,4.25; 26 2.25,4.25; 27 1.75,4.25; 28 1.25,4.25; 29 0.75,4.25; 30 0.25,4.25; 31 -0.25,4.25; 32 -0.75,4.25; 33 -1.25,4.25; 34 -1.75,4.25; 35 -2.25,4.25; 36 -2.75,4.25 | smd 1.2 x 0.3: 13 4.25,-2.75; 14 4.25,-2.25; 15 4.25,-1.75; 16 4.25,-1.25; 17 4.25,-0.75; 18 4.25,-0.25; 19 4.25,0.25; 20 4.25,0.75; 21 4.25,1.25; 22 4.25,1.75; 23 4.25,2.25; 24 4.25,2.75; 37 -4.25,2.75; 38 -4.25,2.25; 39 -4.25,1.75; 40 -4.25,1.25; 41 -4.25,0.75; 42 -4.25,0.25; 43 -4.25,-0.25; 44 -4.25,-0.75; 45 -4.25,-1.25; 46 -4.25,-1.75; 47 -4.25,-2.25; 48 -4.25,-2.75
LQFP-64 = smd 1.5 x 0.3: 1 -5.7,3.75; 2 -5.7,3.25; 3 -5.7,2.75; 4 -5.7,2.25; 5 -5.7,1.75; 6 -5.7,1.25; 7 -5.7,0.75; 8 -5.7,0.25; 9 -5.7,-0.25; 10 -5.7,-0.75; 11 -5.7,-1.25; 12 -5.7,-1.75; 13 -5.7,-2.25; 14 -5.7,-2.75; 15 -5.7,-3.25; 16 -5.7,-3.75; 33 5.7,-3.75; 34 5.7,-3.25; 35 5.7,-2.75; 36 5.7,-2.25; 37 5.7,-1.75; 38 5.7,-1.25; 39 5.7,-0.75; 40 5.7,-0.25; 41 5.7,0.25; 42 5.7,0.75; 43 5.7,1.25; 44 5.7,1.75; 45 5.7,2.25; 46 5.7,2.75; 47 5.7,3.25; 48 5.7,3.75 | smd 0.3 x 1.5: 17 -3.75,-5.7; 18 -3.25,-5.7; 19 -2.75,-5.7; 20 -2.25,-5.7; 21 -1.75,-5.7; 22 -1.25,-5.7; 23 -0.75,-5.7; 24 -0.25,-5.7; 25 0.25,-5.7; 26 0.75,-5.7; 27 1.25,-5.7; 28 1.75,-5.7; 29 2.25,-5.7; 30 2.75,-5.7; 31 3.25,-5.7; 32 3.75,-5.7; 49 3.75,5.7; 50 3.25,5.7; 51 2.75,5.7; 52 2.25,5.7; 53 1.75,5.7; 54 1.25,5.7; 55 0.75,5.7; 56 0.25,5.7; 57 -0.25,5.7; 58 -0.75,5.7; 59 -1.25,5.7; 60 -1.75,5.7; 61 -2.25,5.7; 62 -2.75,5.7; 63 -3.25,5.7; 64 -3.75,5.7
X2QFN-0.4 = smd 0.7 x 0.2: 1 -0.65,0.2; 2 -0.65,-0.2; 7 0.65,-0.2; 8 0.65,0.2 | smd 0.2 x 0.5: 3 -0.6,-0.75; 4 -0.2,-0.75; 5 0.2,-0.75; 6 0.6,-0.75; 9 0.6,0.75; 10 0.2,0.75; 11 -0.2,0.75; 12 -0.6,0.75
HOLYIOT-17051-NRF51822 = drill 0.6 square: 1 -11,9; 21 9,9 | drill 0.6: 2 -11,7; 3 -11,5; 4 -11,3; 5 -11,1; 6 -11,-1; 7 -11,-3; 8 -11,-5; 9 -11,-7; 10 -11,-9; 11 -9,-9; 12 -9,-7; 13 -9,-5; 14 -9,-3; 15 -9,-1; 16 -9,1; 17 -9,3; 18 -9,5; 19 -9,7; 20 -9,9; 22 9,7; 23 9,5; 24 9,3; 25 9,1; 26 9,-1; 27 9,-3; 28 9,-5; 29 9,-7; 30 9,-9; 31 11,-9; 32 11,-7; 33 11,-5; 34 11,-3; 35 11,-1; 36 11,1; 37 11,3; 38 11,5; 39 11,7; 40 11,9
SOT223 = smd 1.3 x 1.3: 1 -2.3,-3.05; 2 0,-3.05; 3 2.3,-3.05 | smd 3.6 x 1.3: 4 0,3.05
SOT23-5 = smd 0.55 x 1: 1 -0.95,-1.35; 2 0,-1.35; 3 0.95,-1.35; 4 0.95,1.35; 5 -0.95,1.35

### Placement (x,y rotation side)
C1  42.75,24 180 top
C2  45.9,24 0 top
C3  51.9,29.25 180 top
C4  51.9,33.15 180 top
C5  38.4,33 0 top
C6  37.8,42 0 top
C7  51.75,40.95 180 top
C8  39.45,17.55 270 top
C9  39.45,20.7 90 top
C10  36.45,7.8 90 top
C11  17.55,29.1 0 top
C12  16.05,15.3 90 top
C13  30,13.2 180 top
C14  31.65,25.05 270 top
C15  17.55,35.7 180 top
C16  12.15,14.85 270 top
C17  67.5,38.1 0 top
C18  24.6,37.95 90 top
C19  24.6,34.8 270 top
C20  22.65,34.8 270 top
C21  22.65,37.95 90 top
C22  10.8,9.3 270 top
C23  11.55,38.85 90 top
CN1  42.73,48.56 180 top
CN2  0,14.7 270 top
CN3  0,35.55 270 top
D1  18.6,47.25 0 top
JP1  73.8,4.8 0 top
JP2  9.45,45.6 270 top
JP7  16.05,43.35 180 top
JP8  61.5,9.75 0 top
JP9  29.1,31.35 180 top
JP10  75.15,9.45 0 top
JP11  48.15,19.95 0 top
JP12  48.15,14.85 0 top
JP13  48.15,9.75 0 top
LED1  55.95,43.95 270 top
LED2  55.95,45.9 90 top
LED3  1.95,28.2 270 top
LED4  1.95,26.4 270 top
LED5  1.95,24.45 270 top
LED6  1.95,22.5 270 top
LED7  67.2,47.25 270 top
LED8  67.2,45.3 270 top
LED9  67.2,43.35 270 top
LED10  67.2,41.4 270 top
Q1  44.38,27.75 0 top
Q2  32.1,42.15 90 top
Q3  35.7,19.15 90 top
Q4  13.8,47.4 270 top
R1  35.85,36.75 180 top
R2  38.4,31.05 0 top
R3  51.9,31.2 0 top
R4  35.7,45.9 180 top
R5  37.8,43.95 0 top
R6  37.8,40.05 0 top
R7  47.1,44.25 180 top
R8  52.65,45.9 0 top
R9  52.65,43.95 180 top
R10  34.5,7.8 270 top
R11  24.9,10.8 90 top
R12  8.85,9.3 270 top
R13  11.55,31.2 0 top
R14  14.1,15.3 270 top
R15  17.55,33.75 180 top
R16  52.65,47.85 180 top
R17  61.2,21 90 top
R18  18,7.65 90 top
R19  59.25,21 90 top
R20  12.75,9.3 90 top
R21  67.05,21 270 top
R22  7.95,28.35 180 top
R23  7.95,26.4 180 top
R24  7.95,24.44 180 top
R25  7.95,22.5 180 top
R26  70.2,47.25 180 top
R27  70.2,45.3 180 top
R28  70.2,43.35 180 top
R29  70.2,41.4 180 top
R30  65.1,21 270 top
R31  63.15,21 270 top
R32  17.55,31.05 0 top
R33  11.85,34.35 90 top
TP1  30.75,46.35 0 top
TP2  42,43.65 0 top
TP3  36.45,10.95 0 top
TP4  22.05,7.05 180 top
TP5  23.85,7.05 180 top
TP6  25.65,7.05 180 top
TP7  27.45,7.05 180 top
TP8  55.35,38.4 270 top
TP9  57.15,38.4 270 top
TP10  58.95,38.4 0 top
TP11  60.75,38.4 0 top
TP13  51.9,27 0 top
U1  44.68,37.54 0 top
U2  23.6,20.73 180 top
U3  15.3,8.1 0 top
U4  13.95,34.35 0 top
U5  67.65,25.05 270 top
U6  29.85,36.75 270 top
U7  15.6,11.4 270 top
U8  14.55,38.55 270 top

### Tracks (layer width: path | path; a pad name or v marks a point on that pad's centre or on a via)
+3V3  (via drill 0.3)
  Top 0.15: Q2.3 31,39.65 31.05,39.6 | C4.2 51.9,32.3 51.9,32.14 52.76,31.28 R3.2 | C13.2 33.15,9.2 33.15,8.14 34.35,6.94 R10.2 | C16.2 13.13,13.03 15.44,13.03 15.88,12.6 15.88,10.96 14.7,9.78 U3.12 | C15.2 16.03,36.38 13.97,36.38 13.35,35.76 U4.12 | U5.7 63.6,35 63.6,25.95 61.2,23.55 R17.2 R19.2
  Top 0.3: 38.86,41.79 U1.36 | U1.1 40.5,33.29 | 40.5,33.29 39.54,33.29 | 40.43,33.36 40.5,33.29 | LED7.A LED8.A | LED8.A LED9.A LED10.A 66.45,38.3 C17.1 | LED2.A 60.6,45.9 61.2,45.3 LED8.A | U1.24 50.24,40.29 C7.2 | U1.9 45.93,32.52 46.2,32.25 50.15,32.25 C4.2 | C11.2 19.85,27.65 U2.32 | U2.13 30.43,22.98 31.63,24.18 | 31.63,24.18 C14.2 | 31.63,24.18 30.75,25.05 27.9,25.05 26.69,25.05 26.35,25.39 U2.19 | U2.64 27.35,13.75 27.9,13.2 v29.1,13.2 C13.2 29.3,13.35 U2.1 | v17.55,16.15 17.9,16.5 U2.48 | 40.5,33.29 40.43,33.36 | 40.43,33.36 U1.48
  Top 0.4: 31.35,39.6 33.6,39.6 v34.5,38.7 | C6.2 38.86,41.79 | 39.54,33.29 C5.2 | LED6.A LED5.A LED4.A LED3.A 1.2,30.54 1.05,30.69 1.05,35.1 v4.5,38.55 | C16.2 13.05,14.9 13.05,15.12 R14.1 | 14.11,16.15 R14.1 | 31.05,39.6 31.35,39.6 | 31.35,39.6 30.9,39.6 28.05,36.75 U6.2 26.45,37.1 C18.1 C21.1 20.75,37.1 v20.1,37.75 | R14.1 14.11,16.15 | 14.11,16.15 C12.2 v17.55,16.15 | U5.7 66.65,38.05 C17.1
  Bottom 0.4: v34.5,38.7 37.31,38.7 | 37.31,38.7 R6.2 38.66,41.99 | 37.31,38.7 39.25,36.77 C5.2 50.9,33 C4.2 | C6.2 49.85,42 C7.2 50.9,40.2 52.55,38.55 62.15,38.55 U5.7 | v17.55,16.15 17.9,16.5 20.43,16.5 21.6,17.67 21.6,24.15 | v4.5,38.55 4.5,40.14 5.64,41.27 10.65,41.27 | 10.65,41.27 15.43,41.27 18.41,38.29 18.41,37.8 | 18.41,35.7 R15.1 18.41,29.12 C11.2 21.6,25.9 21.6,24.15 | 18.41,35.7 18.41,37.8 | C15.2 18.41,35.7 | v20.1,37.75 18.46,37.75 18.41,37.8 | 29.1,24.2 C14.2 | v29.1,13.2 29.1,24.2 | 21.6,24.15 21.65,24.2 29.1,24.2 | JP2.2 10.65,44.4 10.65,41.27
  Bottom 0.6: C6.2 38.66,41.99
  other vias: 16.7,35.7 38.66,40.05 38.65,42 39.25,33 51.05,33.15 50.9,40.95 18.41,33.75 18.4,29.1 31.65,24.2
+5V  (via drill 0.3)
  Top 0.4: v17.55,38.1 19.9,35.75 22.55,35.75 C20.1 C19.1 25.6,35.65 U6.3 | v17.55,38.1 20.55,41.1 20.55,43.5 18.45,45.6 16.8,47.25 D1.C 16.55,47.4 Q4.3 11.84,47.4 11.1,48.14 JP2.1 | U7.5 v16.95,13.1 | v17.55,38.1 16.15,39.5 U8.5
  Bottom 0.4: v16.95,13.1 16.95,15.83 16.9,15.88 16.9,16.42 17.53,17.05 20.21,17.05 20.98,17.82 20.98,25.53 17.75,28.75 17.75,33.7 16.05,35.4 16.05,36.6 v17.55,38.1
BOOT0
  Top 0.15: U2.60 25.35,12.1 R11.2
GND  (via drill 0.3)
  other vias: 13.2,16.95 12.15,13 52.65,39.6 50.7,38.85 47.7,36.9 49.2,44.1 11.7,7.35 15.3,9.6 18.9,7.65 8.85,16.05 15.15,35.7 32.25,13.2 31.05,17.7 38.25,14.55 34.5,10.2 34.95,12.9 36.9,19.2 41.4,15.45 45.9,22.8 30.9,21 34.65,26.1 26.85,22.65 27,18.3 19.8,24 16.8,26.4 22.2,16.8 27.6,11.4 22.8,6 17.4,3.6 18.9,14.85 13.2,4.2 3,13.8 1.2,7.8 4.2,33.45 1.2,38.25 12,43.8 18.9,47.4 16.2,49.2 18,40.2 25.65,44.55 29.25,39.3 30.45,35.7 21.6,30 19.95,34.5 37.8,35.4 34.8,33 36.6,29.4 43.2,31.8 44.4,27.6 43.2,22.2 49.2,15 49.2,9.6 52.8,17.4 65.7,11.4 69.6,13.35 89.25,12 88.8,39 74.4,38.4 68.4,40.2 65.4,44.4 55.2,42 56.4,35.55 48.6,49.2 55.2,48 36.6,49.2 36.6,48 48.6,48 40.8,43.2 42,40.2 43.2,34.8 41.4,31.8 47.4,34.8 46.2,40.2 54.6,9.6 4.35,27.3 9.3,29.4 14.25,29.55 14.85,26.7 15,32.7 16.2,19.95 4.35,23.55 10.95,21.75 39,8.55 54,30.3 64.5,47.1 43.8,12.6 22.95,3.45 41.1,2.7 28.2,14.55 21.15,46.05 32.4,46.05 40.05,45.9 37.8,45.15 39,38.4 31.8,40.5 60,6 26.55,32.55 21,36.45 9,13.2 54.15,21.9 57,19.35 78,48 78,42 60,48 60,42 78,30 72,30 60,30 72,24 78,24 78,18 72,18 66,6 54,6 42,18 30,6 24,21 12.75,25 14.1,23.1 10.95,27.15 15.3,46.05 25.65,36.45 15.3,11.2 9,39.9 13.35,36.75 16.05,14.4 12.9,11.2 8.85,11.2 20.1,28.35 14.7,42 46.8,30.6 52.8,33.15 10.05,36.9 16.65,32.4 14.55,38.55 8.76,33.75 66,30 66,24 60,24 66,18 54,12 72,12 78,12 84,12 89.25,6 77.1,0.75 84,0.75 72,0.75 66,0.75 60,0.75 54,0.75 48,0.75 42,0.75 36,0.75 30,0.75 24,0.75 18,0.75 12,0.75 6,0.75 70.95,7.95
  pour Top: -11.85,57.3 -11.85,-2.4 -11.7,-2.55 91.65,-2.55 96.6,2.4 96.6,49.2 87,58.8 -10.35,58.8
  pour Bottom: -7.05,33.6 -7.05,0.45 -0.6,-6 87.3,-6 95.55,2.25 95.55,45.9 86.7,54.75 -0.6,54.75 -6.9,48.45 -6.9,33.75
NRF_DBG_PIN_0
  Top 0.15: U5.26 65.83,15.23 65.83,13.7 JP10.1
NRF_DBG_PIN_1
  Top 0.15: U5.35 70.2,10.5 71.56,10.5 JP10.2
NRF_DBG_PIN_2
  Top 0.15: U5.25 67.65,15.05 67.65,13.5 70.35,10.8 73.8,10.8 JP10.3
NRF_DBG_PIN_3
  Top 0.15: U5.36 68.65,12.95 70.5,11.1 76.04,11.1 JP10.4
NRF_DBG_TP_0
  Top 0.15: U5.11 57.38,35.33 57.38,36.3 55.35,38.33 TP8.TP
NRF_DBG_TP_1
  Top 0.15: U5.10 58.65,36.9 TP9.TP
NRF_DBG_TP_2
  Top 0.15: TP10.TP 59.68,37.68 59.68,35.03 U5.12
NRF_DBG_TP_3
  Top 0.15: U5.9 60.65,37.1 60.75,37.2 TP11.TP
NRF_LED0
  Top 0.15: R26.1 72.65,45.65 U5.3
NRF_LED1
  Top 0.15: R27.1 72.08,44.28 72.08,36.64 71.83,36.39 71.83,34.88 U5.18
NRF_LED2
  Top 0.15: R28.1 71.78,42.63 71.78,37.18 U5.4
NRF_LED3
  Top 0.15: U5.17 69.83,34.88 69.83,36.43 71.06,37.65 R29.1
NRF_LEDR0
  Top 0.15: LED7.C R26.2
NRF_LEDR1
  Top 0.15: LED8.C R27.2
NRF_LEDR2
  Top 0.15: LED9.C R28.2
NRF_LEDR3
  Top 0.15: LED10.C R29.2
NRF_LOCAL_RX
  Top 0.15: U5.27 63.75,15.15 63.75,13.99 61.82,12.06 61.07,12.06 60.47,11.45 60.47,9.52 JP8.3
NRF_LOCAL_TX
  Top 0.15: JP8.4 61.62,11.02 U5.34
NRF_RX
  Top 0.15: JP13.5 JP8.1
NRF_SWCLK
  Top 0.15: JP11.5 52.86,20.85 52.88,20.85 67.8,20.85 69.6,19.05 69.6,15.1 U5.37
NRF_SWDIO
  Top 0.15: 70.8,15.9 U5.24 70.65,18.43 67.92,21.15 50.69,21.15 JP11.6
NRF_TX
  Top 0.15: JP13.6 JP8.2
SPI_CS  (via drill 0.3)
  Top 0.15: U2.17 29.43,26.43 30.15,27.15 35.25,27.15 v38.25,24.15 | R19.1 58.65,19.54 U5.30
  Bottom 0.15: v38.25,24.15 53.4,24.15 58.65,18.9 U5.30
SPI_IRQ  (via drill 0.3)
  Top 0.15: U2.20 25.85,27.35 26.1,27.6 35.25,27.6 37.95,24.9 v38.4,24.9 | R17.1 59.7,18.64 59.7,15.1 U5.31
  Bottom 0.15: v38.4,24.9 53.07,24.9 59.7,18.28 59.7,15.1 U5.31
SPI_MISO  (via drill 0.3)
  Top 0.15: U2.22 24.85,27.4 25.65,28.2 35.5,28.2 37.3,26.4 v37.8,26.4 | R30.2 61.65,16.69 61.65,15.05 U5.32
  Bottom 0.15: v37.8,26.4 38.25,26.4 38.7,25.95 52.92,25.95 61.65,17.23 61.65,15.05 U5.32 61.8,12.9 65.72,12.9 68.4,10.22 68.4,8.76 72.36,4.8 JP1.2
SPI_MOSI  (via drill 0.3)
  Top 0.15: U2.23 24.35,27.33 25.53,28.5 35.62,28.5 36.97,27.15 v37.5,27.15 | R21.2 66.26,19.35 65.95,19.35 U5.28
  Bottom 0.15: v37.5,27.15 37.92,27.15 38.82,26.25 53.05,26.25 61.95,17.35 61.95,16.75 U5.28 63.75,14.95 63.75,13.79 64.33,13.2 65.84,13.2 68.7,10.34 68.7,8.89 71.74,5.85 74.02,5.85 JP1.3
SPI_SCK  (via drill 0.3)
  Top 0.15: U2.21 25.35,27.28 25.98,27.9 35.37,27.9 37.62,25.65 v38.1,25.65 | R31.2 60.65,17.64 U5.29
  Bottom 0.15: v38.1,25.65 52.8,25.65 60.65,17.8 U5.29 60,15.4 60,14.98 59.79,14.77 59.79,13.72 60.9,12.6 65.59,12.6 68.1,10.1 68.1,8.64 69.99,6.75 JP1.1
STLINK_BOOT0
  Top 0.15: U1.44 36.74,36.79 R1.1
STLINK_LED
  Top 0.15: U1.30 45.06,41.92 45.06,44.43 46.53,45.9 R8.1 R9.2
STLINK_LED_RB
  Top 0.15: R9.1 LED1.A
STLINK_LED_RT
  Top 0.15: R8.2 LED2.C
STLINK_NRST
  Top 0.15: U1.7 44.93,31.87 45.6,31.2 R3.1 C3.2 51.05,27.85 TP13.TP
STLINK_OSC_IN
  Top 0.15: U1.5 43.93,29.72 Q1.1 41.97,24.07 C1.2
STLINK_OSC_OUT
  Top 0.15: U1.6 44.43,30.12 Q1.2 46.79,24.05 C2.2
STLINK_PC13
  Top 0.15: U1.2 42.43,31.63 41.85,31.05 R2.2
STLINK_RX
  Top 0.15: JP13.4 46.95,12.22 46.95,21.63 47.67,22.35 49.34,22.35 55.05,28.06 55.05,33.9 54.16,34.79 U1.13
STLINK_SWCLK
  Top 0.15: TP1.TP 32.1,45 32.1,42.45 32.63,41.93 34.9,41.93 35.87,40.95 40.2,40.95 40.43,40.72 U1.37
STLINK_SWDIO
  Top 0.15: U1.34 42.93,42.72 TP2.TP
STLINK_SWDIO_PD
  Top 0.15: U1.25 47.43,42.78 48,43.35 48,44.2 R7.1
STLINK_TX
  Top 0.15: JP13.3 46.65,9.98 46.65,21.75 47.55,22.65 49.22,22.65 54.75,28.19 54.75,33.78 54.04,34.49 50.84,34.49 49.64,33.29 U1.12
STLINK_USB_ID
  Top 0.15: CN1.ID 42.08,45.08 41.81,44.81 39.79,44.81 38.7,45.9 R4.1
STLINK_USB_N
  Top 0.15: CN1.DM 43.38,44.28 43.8,43.86 43.8,42.75 43.93,42.62 U1.32
STLINK_USB_P
  Top 0.15: CN1.DP 42.73,44.55 | 42.73,44.55 42.73,44.51 43.5,43.74 43.5,42.75 43.43,42.68 U1.33 | R5.2 40.78,43.95 41.34,44.51 42.69,44.51 42.73,44.55
STLINK_USB_RENUM_PU
  Top 0.15: Q2.2 36.1,43.1 R5.1
STLINK_USB_RENUMN
  Top 0.15: Q2.1 34.9,41.2 36.04,40.05 R6.1 37.73,39.28 39.24,39.28 39.76,39.79 U1.38
STLINK_USB_VBUS
  Top 0.15: 44.03,46.72 50.67,46.72 R16.2
  Top 0.4: CN1.VBUS 44.03,46.72 43.65,47.1 34.69,47.1 32.8,49 22.25,49 D1.A 19.4,48.35 Q4.1
STM_DBG_PIN0
  Top 0.15: U2.26 22.85,27.5 24.15,28.8 30.36,28.8 JP9.1
STM_DBG_PIN1
  Top 0.15: U2.27 22.35,27.43 24.03,29.1 28.12,29.1 JP9.2
STM_DBG_PIN2
  Top 0.15: U2.28 21.85,27.4 23.85,29.4 25.88,29.4 JP9.3
STM_DBG_PIN3
  Top 0.15: U2.29 21.35,27.3 | 21.35,27.3 21.35,27.33 | 21.35,27.3 21.35,27.41 JP9.4
STM_DBG_TP_0
  Top 0.15: U2.56 23.35,13.72 23.33,13.69 23.33,8.33 TP4.TP
STM_DBG_TP_1
  Top 0.15: U2.57 23.85,13.79 23.63,13.57 23.63,13.13 23.85,12.9 TP5.TP
STM_DBG_TP_2
  Top 0.15: U2.61 25.85,8.15 25.65,7.95 TP6.TP
STM_DBG_TP_3
  Top 0.15: U2.62 26.35,8.15 TP7.TP
STM_LED0
  Top 0.15: R22.1 10.65,28.35 16.52,22.48 U2.37
STM_LED1
  Top 0.15: U2.38 16.52,21.98 12.11,26.4 R23.1
STM_LED2
  Top 0.15: R24.1 13.51,24.44 16.47,21.48 U2.39
STM_LED3
  Top 0.15: U2.40 16.47,20.98 14.96,22.5 R25.1
STM_LEDR0
  Top 0.15: LED3.C 6.95,28.2 R22.2
STM_LEDR1
  Top 0.15: LED4.C R23.2
STM_LEDR3
  Top 0.15: LED6.C R25.2
STM_LEDR_2
  Top 0.15: LED5.C R24.2
STM_OSC_IN
  Top 0.15: U2.5 33.46,18.98 Q3.1 39.11,16.74 C8.2
STM_OSC_OUT
  Top 0.15: U2.6 33.62,19.48 Q3.2 38.99,21.57 C9.2
STM_RX  (via drill 0.3)
  Top 0.15: U2.59 24.85,13.45 24.75,13.35 v24.75,12.75 | JP13.1 40.43,3.3 25.35,3.3 v24.9,2.85
  Bottom 0.15: v24.75,12.75 24.75,3.45 24.9,3.3 v24.9,2.85
STM_SWCLK  (via drill 0.3)
  Top 0.15: v43.5,15.45 41.85,13.75 41.85,7.53 38.82,4.5 21.6,4.5 19.85,6.25 U2.49
  Bottom 0.15: JP11.1 45.61,17.58 46.64,16.55 46.64,15.69 46.04,15.09 44.43,15.09 44.07,15.45 v43.5,15.45
STM_SWDIO  (via drill 0.3)
  Top 0.15: v43.65,14.7 42.15,13.2 42.15,7.4 38.95,4.2 21.48,4.2 19.48,6.2 19.48,15.88 20.18,16.58 v20.18,18 | v15.15,17.93 15.21,17.98 U2.46
  Bottom 0.15: JP11.2 46.94,19.89 46.94,15.57 46.07,14.7 v43.65,14.7 | v20.18,18 15.23,18 v15.15,17.93
STM_SWO
  Top 0.15: JP12.2 43.42,16.12 41.55,14.25 41.55,7.65 38.85,4.95 38.7,4.8 21.72,4.8 21.19,5.34 21.19,7.41 22.85,9.07 U2.55
STM_SWRST  (via drill 0.3)
  Top 0.15: R10.1 C10.2 TP3.TP 39.08,13.58 v40.2,13.58 40.2,22.2 39.91,22.5 35.24,22.5 32.73,19.98 U2.7
  Bottom 0.15: v40.2,13.58 JP12.1
STM_TX  (via drill 0.3)
  Top 0.15: JP13.2 44.55,9.96 44.55,7.95 40.2,3.6 24.9,3.6 v24.15,2.85 | U2.58 24.35,14.15 24.15,13.95 v24.15,13.35
  Bottom 0.15: v24.15,13.35 v24.15,2.85
SWCLK
  Top 0.15: U1.26 46.93,36.47 47.61,35.79 U1.15 53.58,35.79 55.35,34.03 55.35,27.9 49.2,21.75 49.2,19.73 JP11.3
SWDIO  (via drill 0.3)
  Top 0.15: U1.27 46.43,44.07 R7.2 47.45,45.45 48.9,45.45 51.48,42.88 52.04,42.88 53.85,41.07 53.85,36.38 55.95,34.28 55.95,26.1 v52.65,22.8
  Bottom 0.15: JP11.4 50.26,23.33 52.13,23.33 v52.65,22.8
SWO
  Top 0.15: U1.31 44.43,44.22 46.41,46.2 50.73,46.2 51.21,46.68 52.39,46.68 52.65,46.42 52.65,43.05 54.15,41.55 54.15,36.5 56.25,34.4 56.25,25.6 52.91,22.26 50.26,22.26 49.66,21.65 49.66,21.31 49.65,21.3 49.65,17.62 JP12.4
SWRST  (via drill 0.3)
  Top 0.15: U1.18 52.51,37.29 55.65,34.15 55.65,26.55 v51.9,22.8
  Bottom 0.15: JP12.3 49.23,13.58 50.26,14.62 51.21,14.62 51.9,15.3 v51.9,22.8
UART_NRF2STM  (via drill 0.3)
  Top 0.15: U2.52 21.35,10.3 21.45,10.2 v21.45,9.15 | v21.45,3 22.3,3 23.42,1.88 59.7,1.88 62.85,5.03 62.85,9.83 JP8.6
  Bottom 0.15: v21.45,9.15 v21.45,3
UART_STM2NRF  (via drill 0.3)
  Top 0.15: v20.85,2.4 22.47,2.4 23.3,1.58 59.82,1.58 63.15,4.9 63.15,7.59 JP8.5 | U2.51 v20.85,8.55
  Bottom 0.15: v20.85,8.55 v20.85,2.4
USB_FS_CC1  (via drill 0.3)
  Top 0.15: v5.85,15.9 7.31,15.9 CN2.A5 | U3.1 14.2,8.3 13.83,8.68 13.83,9 13.83,9.14 13.52,9.45 5.73,9.45 v5.13,10.05
  Bottom 0.15: v5.85,15.9 5.85,12.42 5.13,11.7 v5.13,10.05
USB_FS_CC2
  Top 0.15: CN2.B5 6.5,12.95 4.61,11.06 4.61,9.84 5.29,9.15 13.39,9.15 13.53,9.02 13.53,8.53 14.15,7.9 U3.2
USB_FS_HS_VBUS
  Top 0.4: Q4.2 12.95,46.45 JP7.2
USB_FS_ID
  Top 0.15: U2.43 18.77,19.48 19.05,19.2 19.05,16.8 17.4,15.15 15.46,15.15 15.33,15.02 15.33,14.4 | U3.9 15.9,10.5 16.2,10.8 16.2,12.9 15.33,13.78 15.33,14.4 | 14.14,14.4 R14.2 14.14,14.4 | 14.14,14.4 15.33,14.4
USB_FS_ISET
  Top 0.15: U7.3 13.04,10.45 R20.2
USB_FS_N
  Top 0.15: U2.44 16.88,18.98 16.8,18.9 13.29,18.9 8.84,14.45 8.55,14.45 | CN2.A7 8.25,14.45 8.55,14.45 | CN2.B7 8.4,15.45 8.55,15.3 8.55,14.45
USB_FS_ON
  Top 0.15: U2.41 18.79,20.48 19.65,19.63 19.65,16.5 17.99,14.84 17.99,11.24 17.2,10.45 U7.4 17.15,10.45 18,9.6 R18.2
USB_FS_P
  Top 0.15: U2.45 16.92,18.48 16.8,18.6 13.41,18.6 8.76,13.95 CN2.B6 7.11,13.95 6.86,14.21 6.86,14.7 7.11,14.95 CN2.A6
USB_FS_VBUS  (via drill 0.3, 0.3 pad 0.6)
  Top 0.15: v15.3,12.3 14.3,12.3 U7.1 | R12.1 10.79,10.16 C22.1 | v16.8,11.55 17.24,11.55 17.69,12 17.69,15.02 19.35,16.68 19.35,19.35 18.72,19.98 U2.42
  Top 0.4: CN2.A9 v8.78,12.3 10.8,10.28 C22.1 10.8,10.3 12.85,12.35 U7.1 | CN2.A4 v9,17.1 9,19.35 7.87,20.47 1.61,20.47 0.45,21.63 0.45,35.55 6.32,41.43 11.58,41.43 JP7.3
  Bottom 0.15: v16.8,11.55 16.03,12.3 v15.3,12.3
  Bottom 0.4: v8.78,12.3 7.88,12.3 6.45,13.73 6.45,15.6 7.95,17.1 v9,17.1
USB_FS_VBUS_DET
  Top 0.15: U3.4 15.1,6.85 14.85,6.6 10.79,6.6 8.95,8.44 R12.2
USB_HS_CC1
  Top 0.15: U4.1 12.54,34.55 12.49,34.5 11.21,34.5 9.68,36.03 9.68,36.38 9.25,36.8 CN3.A5
USB_HS_CC2  (via drill 0.3)
  Top 0.15: v6.3,36.3 6.3,34.35 6.85,33.8 CN3.B5 | U4.2 12.54,34.15 12.49,34.2 11.08,34.2 9.23,36.06 9.23,36.08 v9.15,36.15
  Bottom 0.15: v6.3,36.3 6.75,36.75 8.55,36.75 v9.15,36.15
USB_HS_ID
  Top 0.15: U4.9 15.35,35.1 R15.2 15.6,32.65 15.6,25.35 16.47,24.48 U2.33
USB_HS_ISET
  Top 0.15: R33.2 11.85,36.45 13,37.6 U8.3
USB_HS_N
  Top 0.15: 8.56,35.3 9.6,34.26 9.6,30.36 16.56,23.4 16.8,23.4 16.88,23.48 U2.35 | CN3.B7 8.4,36.3 8.56,36.14 8.56,35.3 | CN3.A7 8.56,35.3
USB_HS_ON
  Top 0.15: U2.30 20.85,28.65 18.3,31.2 | 18.3,31.2 17.7,31.8 17.7,36.6 16.7,37.6 U8.4 | 18.3,31.2 18.41,31.09 R32.2
USB_HS_P
  Top 0.15: U2.36 16.92,22.98 16.8,23.1 16.44,23.1 9.3,30.24 9.3,34.14 8.64,34.8 CN3.B6 7.05,34.8 6.86,35 6.86,35.66 7,35.8 CN3.A6
USB_HS_VBUS  (via drill 0.3 pad 0.6)
  Top 0.15: v10.65,36.3 10.65,37.95 | U2.34 16.55,23.98 10.69,29.84 R13.1 10.65,31.24 v10.65,33.3
  Top 0.4: CN3.A9 6.9,33.15 5.65,34.4 5.65,36.7 6.9,37.95 CN3.A4 10.65,37.95 11.5,37.95 C23.1 11.55,38.17 12.88,39.5 U8.1 13.5,39.5 14.5,40.5 15.74,40.5 JP7.1
  Bottom 0.15: v10.65,33.3 v10.65,36.3
USB_HS_VBUS_DET
  Top 0.15: R13.2 13.75,32.54 U4.4

### Text on the board
tPlace: PB10 | PB2 | PB1 | PB0
tDocu: FS | +5V | HS | USB-HS | SWDIO | SWCLK | SWO | SWRST | TX | USB-FS | RX | RX | TX | STM32 | ST-LINK | nRF51 | ST-LINK | nRF51 | STM32 | P0.13 | P0.16 | SCK / / MISO / / MOSI / / GND | v1.1 | https://github.com/Tuetuopay/stm32-usb-ble-devkit